# EAGLE design dcc_block_detector (EAGLE 7.2.0)
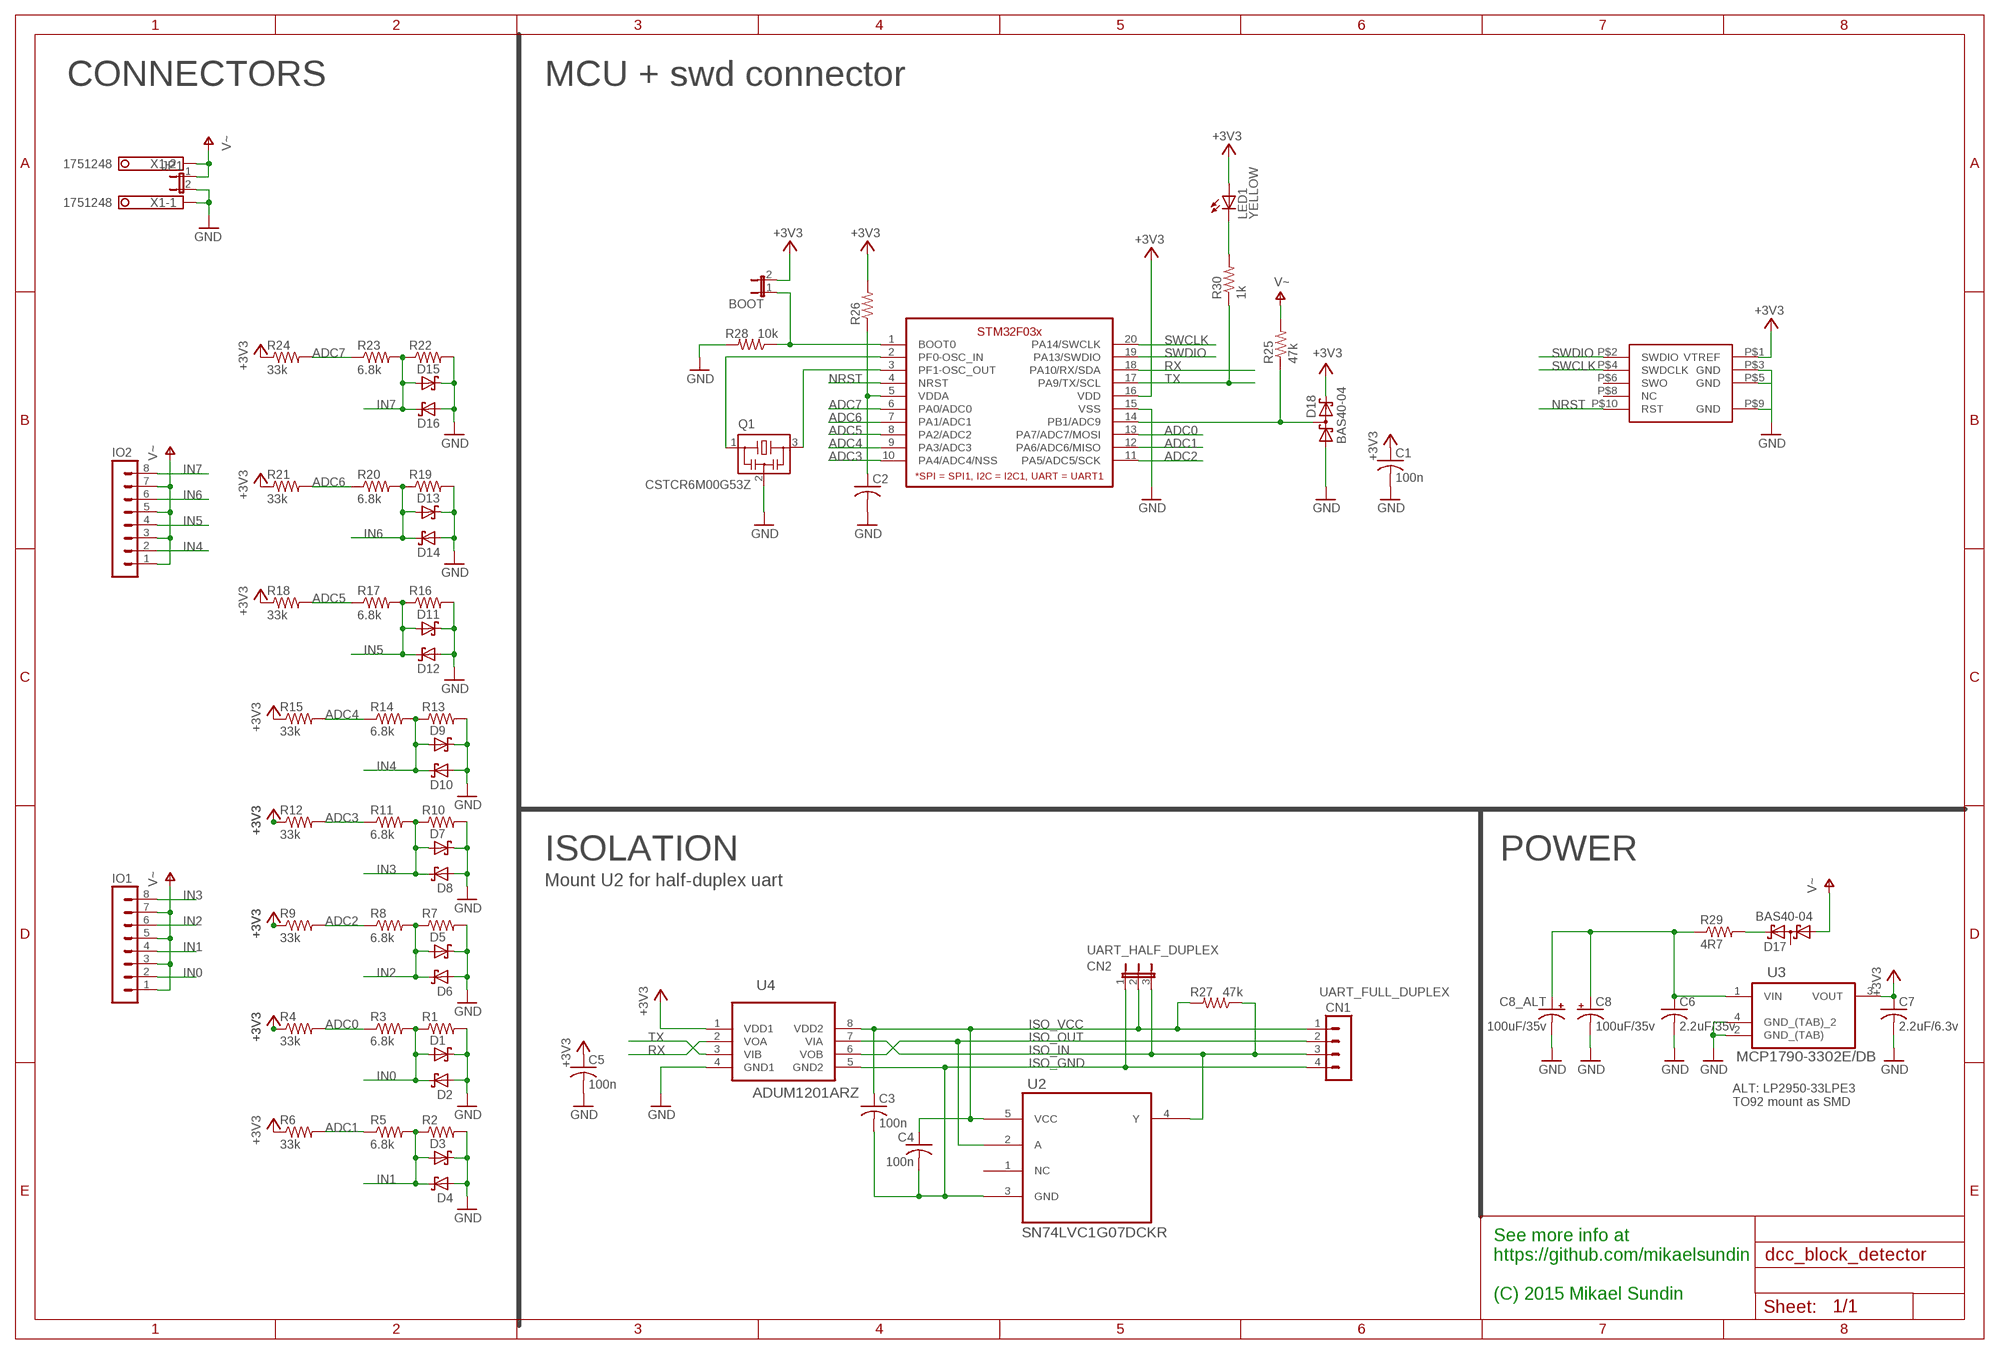
[diagram p0: schematic, sheet 1]

## Parts
BOOT  JP1E  [JP1]
C1  100n  C-USC0603  [C0603]
C2  C-USC0603  [C0603]
C3  100n  C-USC0603  [C0603]
C4  100n  C-USC0603  [C0603]
C5  100n  C-USC0603  [C0603]
C6  2.2uF/35v  C-USC0805  [C0805]
C7  2.2uF/6.3v  C-USC0805  [C0805]
C8  100uF/35v  CPOL-USUD-6,3X7,7  [UD-6,3X7,7_NICHICON]
C8_ALT  100uF/35v  CPOL-USE2.5-6  [E2,5-6]
CN1  UART_FULL_DUPLEX  MA04-1  [MA04-1]
CN2  UART_HALF_DUPLEX  JP2E  [JP2]
D1  SCHOTTKY-DIODESMC  [SMC]
D2  SCHOTTKY-DIODESMC  [SMC]
D3  SCHOTTKY-DIODESMC  [SMC]
D4  SCHOTTKY-DIODESMC  [SMC]
D5  SCHOTTKY-DIODESMC  [SMC]
D6  SCHOTTKY-DIODESMC  [SMC]
D7  SCHOTTKY-DIODESMC  [SMC]
D8  SCHOTTKY-DIODESMC  [SMC]
D9  SCHOTTKY-DIODESMC  [SMC]
D10  SCHOTTKY-DIODESMC  [SMC]
D11  SCHOTTKY-DIODESMC  [SMC]
D12  SCHOTTKY-DIODESMC  [SMC]
D13  SCHOTTKY-DIODESMC  [SMC]
D14  SCHOTTKY-DIODESMC  [SMC]
D15  SCHOTTKY-DIODESMC  [SMC]
D16  SCHOTTKY-DIODESMC  [SMC]
D17  BAS40-04  [SOT23]
D18  BAS40-04  [SOT23]
IO1  MA08-1W  [MA08-1W]
IO2  MA08-1W  [MA08-1W]
JP1  JP1E  [JP1]
LED1  YELLOW  LEDCHIPLED_0603  [CHIPLED_0603]
Q1  CSTCR6M00G53Z  [CSTER12M]
R1  R-US_R1206  [R1206]
R2  R-US_R1206  [R1206]
R3  6.8k  R-US_R0603  [R0603]
R4  33k  R-US_R0603  [R0603]
R5  6.8k  R-US_R0603  [R0603]
R6  33k  R-US_R0603  [R0603]
R7  R-US_R1206  [R1206]
R8  6.8k  R-US_R0603  [R0603]
R9  33k  R-US_R0603  [R0603]
R10  R-US_R1206  [R1206]
R11  6.8k  R-US_R0603  [R0603]
R12  33k  R-US_R0603  [R0603]
R13  R-US_R1206  [R1206]
R14  6.8k  R-US_R0603  [R0603]
R15  33k  R-US_R0603  [R0603]
R16  R-US_R1206  [R1206]
R17  6.8k  R-US_R0603  [R0603]
R18  33k  R-US_R0603  [R0603]
R19  R-US_R1206  [R1206]
R20  6.8k  R-US_R0603  [R0603]
R21  33k  R-US_R0603  [R0603]
R22  R-US_R1206  [R1206]
R23  6.8k  R-US_R0603  [R0603]
R24  33k  R-US_R0603  [R0603]
R25  47k  R-US_R0603  [R0603]
R26  R-US_R0603  [R0603]
R27  47k  R-US_R0603  [R0603]
R28  10k  R-US_R0603  [R0603]
R29  4R7  R-US_R1206  [R1206]
R30  1k  R-US_R0603  [R0603]
U2  SN74LVC1G07DCKR  [SOT65P210X110-5N]
U3  MCP1790-3302E/DB  [SOT230P700X180-4N]
U4  ADUM1201ARZ  [SOIC127P600X175-8N]
U$1  STM32F03X_TSSOP20  [STM32F03X_TSSOP20]
U$2  SWD  ARM_SWD_2X5  [ARM_SWD_2X5]
X1  1751248  [1751248]

## Nets
+3V3: BOOT.2 C1.1 C5.1 C7.1 D18.2(C2) LED1.A R4.1 R6.1 R9.1 R12.1 R15.1 R18.1 R21.1 R24.1 R26.2 U3.3(VOUT) U4.1(VDD1) U$1.16(VDD) U$2.P$1(VTREF)
ADC0: R3.1 R4.2 U$1.13(PA7/ADC7/MOSI)
ADC1: R5.1 R6.2 U$1.12(PA6/ADC6/MISO)
ADC2: R8.1 R9.2 U$1.11(PA5/ADC5/SCK)
ADC3: R11.1 R12.2 U$1.10(PA4/ADC4/NSS)
ADC4: R14.1 R15.2 U$1.9(PA3/ADC3)
ADC5: R17.1 R18.2 U$1.8(PA2/ADC2)
ADC6: R20.1 R21.2 U$1.7(PA1/ADC1)
ADC7: R23.1 R24.2 U$1.6(PA0/ADC0)
GND: C1.2 C2.2 C5.2 C6.2 C7.2 C8.- C8_ALT.- D1.C D2.A D3.C D4.A D5.C D6.A D7.C D8.A D9.C D10.A D11.C D12.A D13.C D14.A D15.C D16.A D18.1(A1) JP1.2 Q1.2 R1.2 R2.2 R7.2 R10.2 R13.2 R16.2 R19.2 R22.2 R28.2 U3.2(GND_(TAB)) U3.4(GND_(TAB)_2) U4.4(GND1) U$1.15(VSS) U$2.P$3(GND) U$2.P$5(GND) U$2.P$9(GND) X1.1
IN0: D1.A D2.C IO1.2 R1.1 R3.2
IN1: D3.A D4.C IO1.4 R2.1 R5.2
IN2: D5.A D6.C IO1.6 R7.1 R8.2
IN3: D7.A D8.C IO1.8 R10.1 R11.2
IN4: D9.A D10.C IO2.2 R13.1 R14.2
IN5: D11.A D12.C IO2.4 R16.1 R17.2
IN6: D13.A D14.C IO2.6 R19.1 R20.2
IN7: D15.A D16.C IO2.8 R22.1 R23.2
ISO_GND: C3.2 C4.2 CN1.4 CN2.1 U2.3(GND) U4.5(GND2)
ISO_IN: CN1.3 CN2.3 R27.1 U2.4(Y) U4.7(VIA)
ISO_OUT: CN1.2 U2.2(A) U4.6(VOB)
ISO_VCC: C3.1 C4.1 CN1.1 CN2.2 R27.2 U2.5(VCC) U4.8(VDD2)
N$1: D18.3(C1A2) R25.1 U$1.14(PB1/ADC9)
N$2: C2.1 R26.1 U$1.5(VDDA)
N$3: D17.2(C2) R29.2
N$4: Q1.1 U$1.2(PF0-OSC_IN)
N$5: Q1.3 U$1.3(PF1-OSC_OUT)
N$6: BOOT.1 R28.1 U$1.1(BOOT0)
N$7: C6.1 C8.+ C8_ALT.+ R29.1 U3.1(VIN)
N$8: LED1.C R30.2
NRST: U$1.4(NRST) U$2.P$10(RST)
RX: U4.2(VOA) U$1.18(PA10/RX/SDA)
SWCLK: U$1.20(PA14/SWCLK) U$2.P$4(SWDCLK)
SWDIO: U$1.19(PA13/SWDIO) U$2.P$2(SWDIO)
TX: R30.1 U4.3(VIB) U$1.17(PA9/TX/SCL)
V+: D17.1(A1) IO1.1 IO1.3 IO1.5 IO1.7 IO2.1 IO2.3 IO2.5 IO2.7 JP1.1 R25.2 X1.2 ; supply symbol labelled V~
Unconnected: D17.3(C1A2) U2.1(NC) U$2.P$6(SWO) U$2.P$8(NC)

## Notes on the sheet
- CONNECTORS | MCU + swd connector
- ISOLATION | POWER
- Mount U2 for half-duplex uart
- ALT: LP2950-33LPE3
  TO92 mount as SMD
- See more info at
  https://github.com/mikaelsundin
  
  (C) 2015 Mikael Sundin

## Library data of the parts
BOOT JP1 = jumper:JP1E: JUMPER
C1-C7 = rcl:C-US: CAPACITOR, American symbol
C8 C8_ALT = rcl:CPOL-US: POLARIZED CAPACITOR, American symbol
CN1 = con-lstb:MA04-1: PIN HEADER; OC_FARNELL: unknown; OC_NEWARK: unknown
CN2 = jumper:JP2E: JUMPER
D1-D16 = diode:SCHOTTKY-DIODE: Schottky Diode
D17 D18 = diode:BAS40-04: Silicon Schottky Diodes General-purpose diode for high-speed switching
IO1 IO2 = con-lstb:MA08-1W: PIN HEADER; OC_FARNELL: unknown; OC_NEWARK: unknown
LED1 = led:LED: LED OSRAM: - CHIPLED LG R971, LG N971, LY N971, LG Q971, LY Q971, LO R971, LY R971 LH N974, LH R974 LS Q976, LO Q976, LY Q976 LO Q996 - Hyper CHIPLED LW Q18S LB Q993, LB Q99A, LB R99A - SideLED LS A670, LO A670, LY A670, LG A670, LP A670 LB A673, LV A673, LT A673, LW A673 LH A674 LY A675 LS A676, LA A676, LO A676, LY A676, LW A676 LS A679, LY A679, LG A679 - Hyper Micro SIDELED® LS Y876, LA Y876, LO Y876, LY Y876 LT Y87S - SmartLED LW L88C, LW L88S LB L89C, LB L89S, LG L890 LS L89K, LO L89K, LY L89K LS L896, LA L896, LO L896, LY L896 - TOPLED LS T670, LO T670, LY T670, LG T670, LP T670 LSG T670, LSP T670, LSY T670, LOP T670, LYG T670 LG T671, LOG T671, LSG T671 LB T673, LV T673, LT T673, LW T673 LH T674 LS T676, LA T676, LO T676, LY T676, LB T676, LH T676, LSB T676, LW T676 LB T67C, LV T67C, LT T67C, LS T67K, LO T67K, LY T67K, LW E67C LS E67B, LA E67B, LO E67B, LY E67B, LB E67C, LV E67C, LT E67C LW T67C LS T679, LY T679, LG T679 LS T770, LO T770, LY T770, LG T770, LP T770 LB T773, LV T773, LT T773, LW T773 LH T774 LS E675, LA E675, LY E675, LS T675 LS T776, LA T776, LO T776, LY T776, LB T776 LHGB T686 LT T68C, LB T68C - Hyper Mini TOPLED® LB M676 - Mini TOPLED Santana® LG M470 LS M47K, LO M47K, LY M47K Source: http://www.osram.convergy.de LUXEON: - LUMILED® LXK2-PW12-R00, LXK2-PW12-S00, LXK2-PW14-U00, LXK2-PW14-V00 LXK2-PM12-R00, LXK2-PM12-S00, LXK2-PM14-U00 LXK2-PE12-Q00, LXK2-PE12-R00, LXK2-PE12-S00, LXK2-PE14-T00, LXK2-PE14-U00 LXK2-PB12-K00, LXK2-PB12-L00, LXK2-PB12-M00, LXK2-PB14-N00, LXK2-PB14-P00, LXK2-PB14-Q00 LXK2-PR12-L00, LXK2-PR12-M00, LXK2-PR14-Q00, LXK2-PR14-R00 LXK2-PD12-Q00, LXK2-PD12-R00, LXK2-PD12-S00 LXK2-PH12-R00, LXK2-PH12-S00 LXK2-PL12-P00, LXK2-PL12-Q00, LXK2-PL12-R00 Source: www.luxeon.com KINGBRIGHT: KA-3528ASYC Source: www.kingbright.com
Q1 = cstce-resonator:CSTCR: Resonator Source: murata.co.jp; MPN: CSTCC12M0; OC_FARNELL: 1170434; OC_NEWARK: 25M8759
R1-R30 = rcl:R-US_: RESISTOR, American symbol
U2 = logic:SN74LVC1G07DCKR: SINGLE BUFFER/DRIVER WITH OPEN-DRAIN OUTPUT; MPN: SN74LVC1G07DCKR; OC_FARNELL: 1287544; OC_NEWARK: 76C4075; PACKAGE: SC70-5; SUPPLIER: Texas Instruments
U3 = lib:MCP1790-3302E/DB: IC, LDO VOLT REG, 3.3V, 70mA; MPN: MCP1790-3302E/DB; OC_FARNELL: 1675422; OC_NEWARK: 40M0645; PACKAGE: SOT-223-3; SUPPLIER: Microchip
U4 = lib:ADUM1201ARZ: Dual-Channel Digital Isolators; MPN: ADUM1201ARZ; OC_FARNELL: 1078200; OC_NEWARK: 19M0753; PACKAGE: SOIC-8; SUPPLIER: Analog Devices
U$1 = stm32f03x:STM32F03X_TSSOP20
U$2 = lib:ARM_SWD_2X5
X1 = con-phoenix-350:1751248: MKDS 1/ 2-3,5 Printklemme Nennstrom: 10 A Bemessungsspannung: 160 V Raster: 3,5 mm Polzahl: 2 Montageart: Löten Anschlussart: Schraubanschluss Anschlussrichtung vom Leiter zur Platine: 0° Source: http://eshop.phoenixcontact.com .. 1751248.pdf; OC_FARNELL: unknown; OC_NEWARK: unknown

## Board
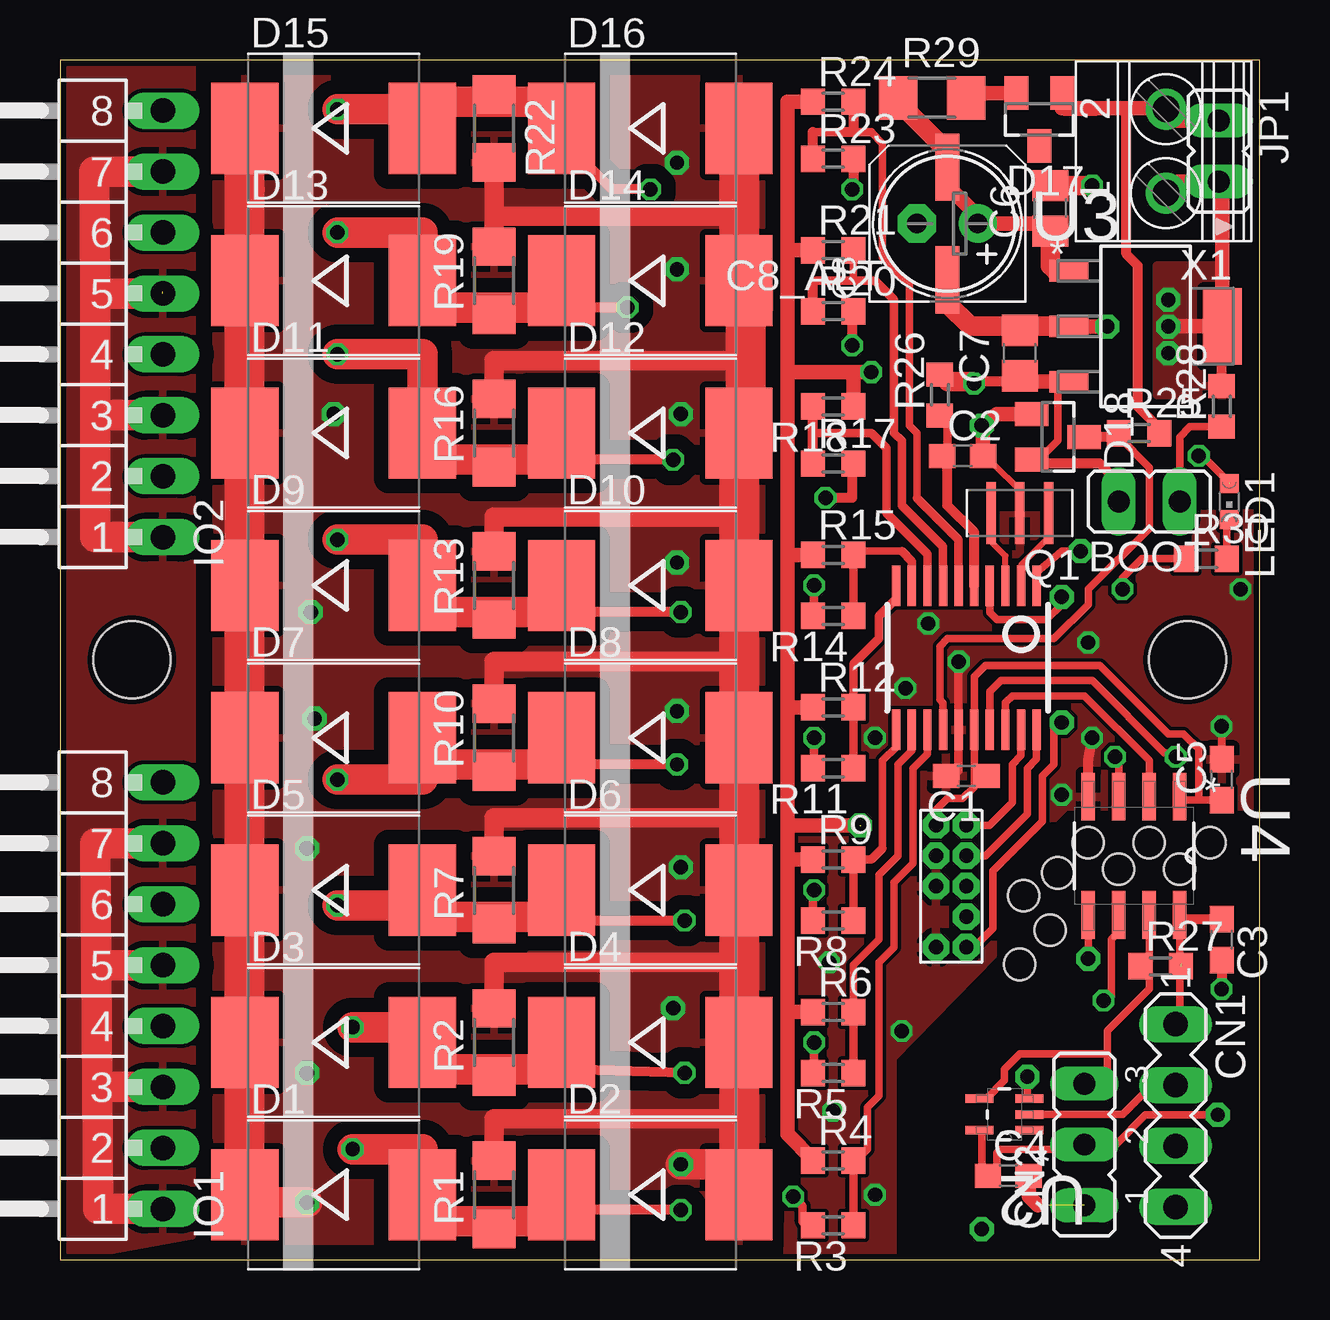
[diagram p1: board, top side]
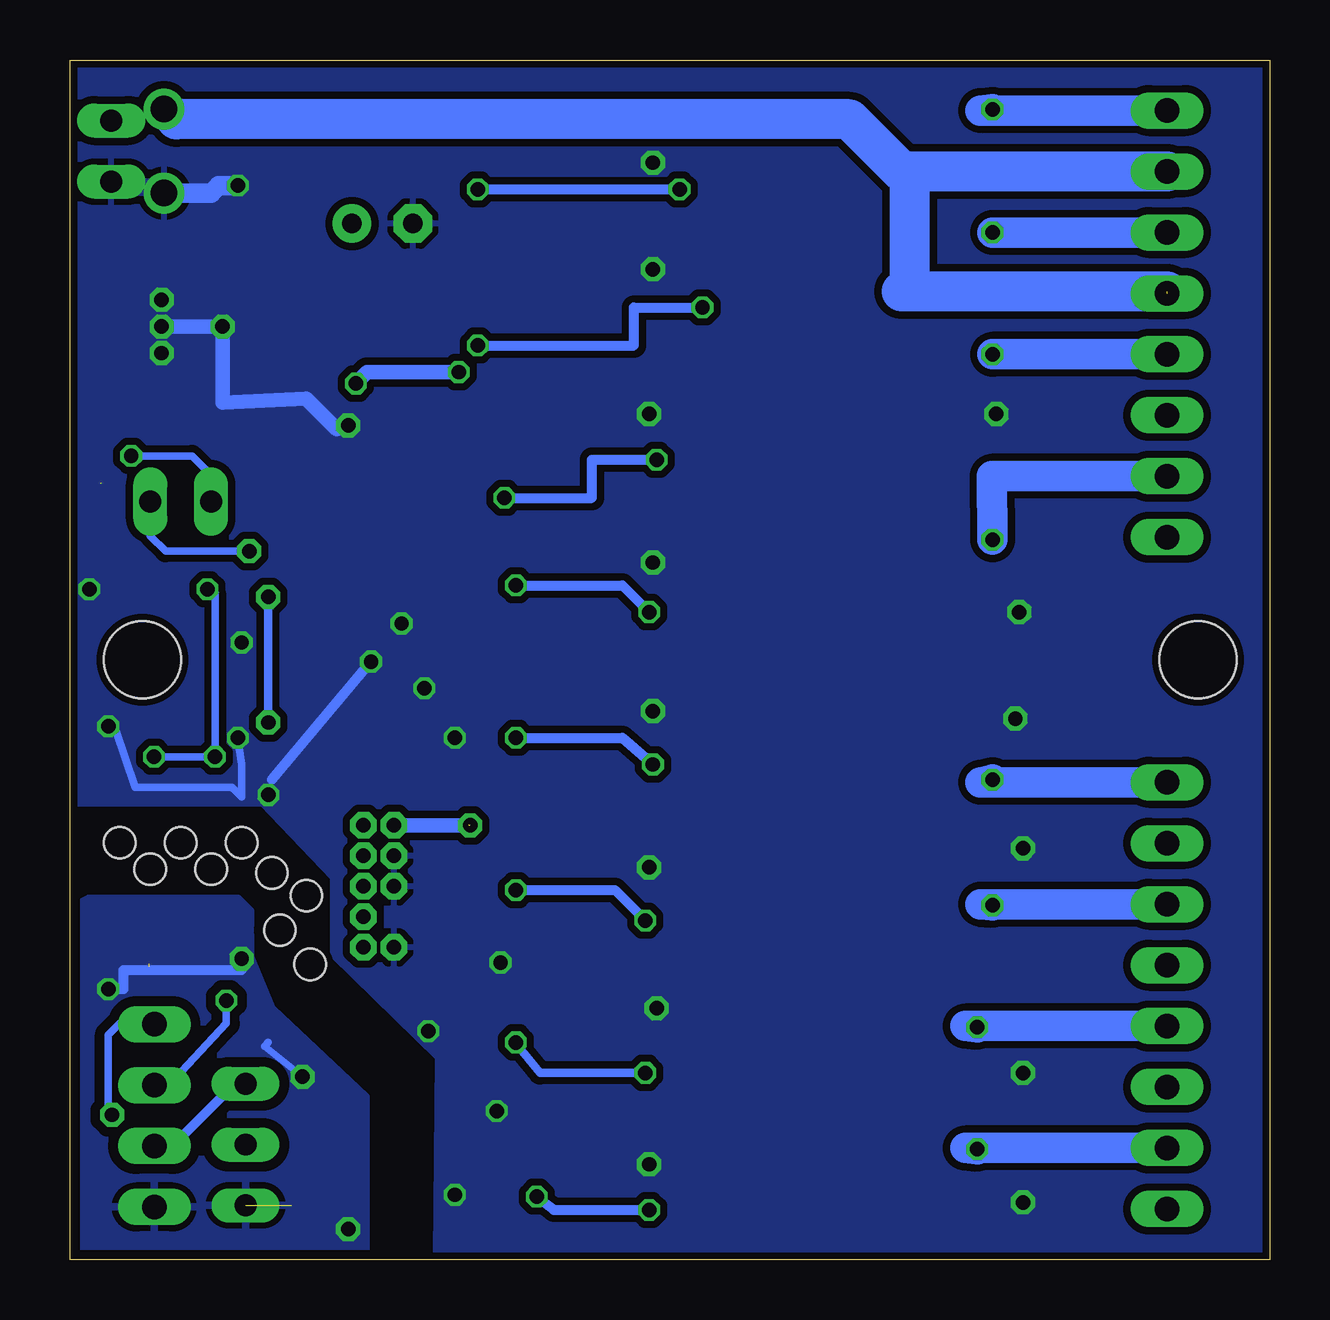
[diagram p2: board, bottom side, seen from below]

Size 50 x 50 mm. Coordinates in mm from the lower left corner, seen from the top.
Outline: 0,0 50,0 50,50 0,50 0,0
Copper layers (1*16): Top 0.035mm / dielectric 1.5mm / Bottom 0.035mm
Design rules "Elecrow_2-layer_eagle_rule": minimum track width 6mil, minimum drill 12mil, track to track 6mil, track to pad 6mil, pad to pad 6mil, via to via 6mil, smd to smd 0mil, copper to edge 10mil, drill to drill 10mil, minimum pad ring 10mil, minimum via ring 6mil, stop-mask expansion 2mil, vias tented up to drill 100mil, thermal gap 10mil
Holes 3.2 mm at 3,25 47,25
Holes 1.3 mm at 42.86,17.38 44.13,16.27 45.4,17.38 46.67,16.27 40.01,12.3 41.59,16.11 40.16,15.16 41.27,13.73 47.94,17.38

### Footprints (pad centres in the part's own frame; a part is rotated, then mirrored left to right if it is on the bottom)
JP1 = drill 0.914 long: 1 0,-1.27; 2 0,1.27
C0603 = smd 1.1 x 1: 1 -0.85,0; 2 0.85,0
C0805 = smd 1.3 x 1.5: 1 -0.95,0; 2 0.95,0
UD-6,3X7,7_NICHICON = smd 2.8 x 1: + 2.35,0; - -2.35,0
E2,5-6 = drill 0.813 pad 1.6: + -1.27,0 | drill 0.813 pad 1.6 octagon: - 1.27,0
MA04-1 = drill 1.016 long: 1 -3.81,0; 2 -1.27,0; 3 1.27,0; 4 3.81,0
JP2 = drill 0.914 long: 1 -2.54,0; 2 0,0; 3 2.54,0
SMC = smd 2.8 x 3.8: A 3.7,0; C -3.7,0
SOT23 = smd 1 x 1.4: 1 -0.95,-1.1; 2 0.95,-1.1; 3 0,1.1
MA08-1W = drill 1.016 long: 1 -8.89,0; 2 -6.35,0; 3 -3.81,0; 4 -1.27,0; 5 1.27,0; 6 3.81,0; 7 6.35,0; 8 8.89,0
CHIPLED_0603 = smd 0.8 x 0.8: A 0,-0.75; C 0,0.75
CSTER12M = smd 0.4 x 2.6: 1 -1.2,0; 2 0,0; 3 1.2,0
R1206 = smd 1.6 x 1.803: 1 -1.422,0; 2 1.422,0
R0603 = smd 1 x 1.1: 1 -0.85,0; 2 0.85,0
SOT65P210X110-5N = smd 1.168 x 0.356: 1 -1.041,0.66; 2 -1.041,0; 3 -1.041,-0.66; 4 1.041,-0.66; 5 1.041,0.66
SOT230P700X180-4N = smd 1.626 x 0.889: 1 -3.2,2.311; 2 -3.2,0; 3 -3.2,-2.311 | smd 1.626 x 3.175: 4 3.2,0
SOIC127P600X175-8N = smd 1.981 x 0.559: 1 -2.464,1.905; 2 -2.464,0.635; 3 -2.464,-0.635; 4 -2.464,-1.905; 5 2.464,-1.905; 6 2.464,-0.635; 7 2.464,0.635; 8 2.464,1.905
STM32F03X_TSSOP20 = smd 0.35 x 1.7: 1 -2.925,-3; 2 -2.275,-3; 3 -1.625,-3; 4 -0.975,-3; 5 -0.325,-3; 6 0.325,-3; 7 0.975,-3; 8 1.625,-3; 9 2.275,-3; 10 2.925,-3; 11 2.925,3; 12 2.275,3; 13 1.625,3; 14 0.975,3; 15 0.325,3; 16 -0.325,3; 17 -0.975,3; 18 -1.625,3; 19 -2.275,3; 20 -2.925,3
ARM_SWD_2X5 = drill 0.6 pad 1 octagon: P$1 2.54,0.635; P$2 2.54,-0.635; P$3 1.27,0.635; P$4 1.27,-0.635; P$5 0,0.635; P$6 0,-0.635; P$8 -1.27,-0.635; P$9 -2.54,0.635; P$10 -2.54,-0.635
1751248 = drill 1.1 pad 1.7: 1 -1.75,-0.1; 2 1.75,-0.1

### Placement (x,y rotation side)
BOOT  45.4,31.59 90 top
C1  37.78,20.16 180 top
C2  37.62,33.5 0 top
C3  48.42,13.34 270 top
C4  39.53,3.49 0 top
C5  48.42,20 90 top
C6  41.27,43.81 90 top
C7  40.01,37.78 90 top
C8  36.99,43.18 90 top
C8_ALT  36.99,43.18 180 top
CN1  46.5,6 270 top
CN2  42.7,4.79 90 top
D1  11.41,2.7 0 top
D2  24.61,2.7 0 top
D3  11.41,9.05 0 top
D4  24.61,9.05 0 top
D5  11.41,15.4 0 top
D6  24.61,15.4 0 top
D7  11.41,21.75 0 top
D8  24.61,21.75 0 top
D9  11.41,28.1 0 top
D10  24.61,28.1 0 top
D11  11.41,34.45 0 top
D12  24.61,34.45 0 top
D13  11.41,40.8 0 top
D14  24.61,40.8 0 top
D15  11.41,47.15 0 top
D16  24.61,47.15 0 top
D17  40.82,47.52 180 top
D18  41.59,34.29 270 top
IO1  4.29,11 90 top
IO2  4.29,39 90 top
JP1  48.3,46.2 180 top
LED1  48.74,31.59 180 top
Q1  40.01,31.11 180 top
R1  18.1,2.7 90 top
R2  18.1,9.05 90 top
R3  32.23,1.43 180 top
R4  32.23,4.13 0 top
R5  32.23,7.78 180 top
R6  32.23,10.32 0 top
R7  18.1,15.4 90 top
R8  32.23,14.13 180 top
R9  32.23,16.67 0 top
R10  18.1,21.75 90 top
R11  32.23,20.48 180 top
R12  32.23,23.02 0 top
R13  18.1,28.1 90 top
R14  32.23,26.83 180 top
R15  32.23,29.37 0 top
R16  18.1,34.45 90 top
R17  32.23,33.18 0 top
R18  32.23,35.56 180 top
R19  18.1,40.8 90 top
R20  32.23,39.53 0 top
R21  32.23,42.07 0 top
R22  18.1,47.15 270 top
R23  32.23,45.88 0 top
R24  32.23,48.26 0 top
R25  44.98,34.45 0 top
R26  36.67,36.04 90 top
R27  45.88,12.22 0 top
R28  48.42,35.56 90 top
R29  36.35,48.42 0 top
R30  47.78,29.21 0 top
U2  39.37,6.05 180 top
U3  45.25,38.9 0 top
U4  44.77,16.83 270 top
U$1  37.78,25.08 180 top
U$2  37.15,15.56 90 top
X1  46,46.2 90 top

### Tracks (layer width: path | path; a pad name or v marks a point on that pad's centre or on a via)
+3V3  (via drill 0.6, 0.6 pad 1)  (2 unrouted)
  Top 0.305: D18.2 41.12,33.66 41.59,34.13 41.59,36.35 42.12,36.35 | 42.7,36.35 42.12,36.35 | 42.12,36.35 U3.3 | C5.1 47.47,19.15 | 47.47,19.15 46.81,19.15 U4.1 46.67,18.89 | U$2.P$1 36.51,18.73 36.99,19.21 37.62,19.21 38.11,19.69 38.11,20.16 | 38.11,20.16 U$1.16 38.11,24.3 38.58,24.77 43.34,24.77 46.2,21.91 46.83,21.91 47.47,21.27 47.47,19.15 | C1.1 38.11,20.16 | 48.74,32.38 47.62,33.5 v47.47,33.5
  Top 0.406: R4.1 31.41,4.13 | 40.01,36.59 37.01,36.59 | BOOT.2 44.13,32.38 43.34,33.18 40.65,33.18 D18.2
  Top 0.61: 31.41,4.13 30.32,5.24 30.32,10.48 | 30.32,10.48 30.32,16.83 | 30.32,16.83 30.32,18.1 | 30.32,18.1 30.32,23.02 | 30.32,23.02 30.32,29.53 | 30.32,29.53 30.32,36.99 | 30.32,36.99 30.32,42.07 | 30.32,42.07 30.32,48.26 R24.1 | 33.39,18.1 30.32,18.1 | R18.1 33.08,36.99 | 33.08,36.99 30.32,36.99 | v33.81,36.99 33.08,36.99 | U3.3 40.01,36.59 | 36.99,36.59 37.01,36.59 R26.2 36.99,36.59 | 36.99,36.62 36.99,36.59 | R21.1 30.32,42.07 | R15.1 30.48,29.37 30.32,29.53 | R12.1 30.32,23.02 | R9.1 30.48,16.67 30.32,16.83 | R6.1 30.48,10.32 30.32,10.48
  Top 0.813: C7.1 40.01,36.59 | 37.01,36.59 38.03,36.59 v38.1,36.51
  Bottom 0.305: 47.47,33.66 v47.47,33.5 44.93,33.5 44.13,32.7 BOOT.2
  Bottom 0.61: v38.1,36.51 37.62,36.99 v33.81,36.99 | U$2.P$1 v33.34,18.1
ADC0
  Top 0.305: 32.86,3.91 R4.2 33.18,4.13 33.66,4.6 33.66,6.35 34.13,6.83 34.13,12.38 34.77,13.02 34.77,15.72 35.56,16.51 35.56,20.48 36.16,21.08 U$1.13
  Top 0.356: R3.1 R4.2
ADC1
  Top 0.305: U$1.12 35.51,21.22 34.92,20.64 34.92,16.83 34.13,16.03 34.13,13.34 33.08,12.28 R6.2
  Top 0.356: R5.1 R6.2
ADC2
  Top 0.305: U$1.11 34.86,21.36 34.29,20.8 34.29,17.14
  Top 0.356: R8.1 R9.2 33.81,16.67 34.29,17.14
ADC3
  Top 0.356: 33.02,22.96 R12.2 | R11.1 R12.2 | R12.2 33.08,24.82 34.13,25.88 34.13,26.83 34.86,27.55 U$1.10
ADC4
  Top 0.305: 35.08,29.53 33.23,29.53 R15.2 33.02,29.31
  Top 0.356: U$1.9 35.51,29.1 35.08,29.53 | R14.1 R15.2
ADC5
  Top 0.356: U$1.8 36.16,29.41 34.45,31.11 34.45,33.81 33.81,34.45 31.38,34.45
  Top 0.406: R17.1 31.38,34.45 R18.2
ADC6
  Top 0.305: R21.2 33.08,40.8 33.66,40.8
  Top 0.356: U$1.7 36.81,29.71 35.08,31.43 35.08,34.13 34.77,34.45 34.77,40.01 33.97,40.8 33.66,40.8 31.54,40.8 31.38,40.64
  Top 0.406: R20.1 31.38,40.64
ADC7
  Top 0.305: 35.72,31.75 35.72,34.45 35.4,34.77 35.4,40.64 34.29,41.75 34.29,46.51 33.81,46.99
  Top 0.356: U$1.6 37.46,30.01 35.72,31.75 | 33.81,46.99 32.54,46.99 31.38,46.99
  Top 0.406: R23.1 31.38,46.99 | R24.2 33.08,46.99 32.54,46.99
GND  (via drill 0.6, 0.6 pad 1)
  Top 0.254: C2.2 38.89,33.18 40.01,32.07 Q1.2
  Top 0.305: C5.2 v48.42,22.23
  Top 0.356: v37.47,24.92 37.46,24.93 U$1.15 37.46,20.37 C1.2
  Top 0.406: R28.2 48.42,38.71 U3.4 | U4.4 42.94,19.29 42.86,19.37 42.86,20.8 v43.02,21.75
  Top 0.61: D18.1 39.05,35.24 v38.42,34.77 38.47,34.82 C2.2 | v43.66,38.89 U3.2 | v46.2,38.89 46.04,38.9 U3.4 48.45,44.74 48.26,44.93 46.58,44.93 X1.1 | 7.87,44.45 7.71,44.61
  Top 0.813: R1.2 18.1,5.87 28.31,5.87 | R2.2 18.1,12.38 28.31,12.38 | R7.2 18.1,18.41 28.31,18.41 | R10.2 18.1,24.92 28.31,24.92 | R13.2 18.1,30.96 28.31,30.96 | R16.2 18.1,37.47 28.57,37.47 | R19.2 18.1,43.5 | 18.1,43.5 28.31,43.5 | R22.2 18.1,43.5 | U3.2 39.85,38.9 | 39.85,38.9 37.94,38.9 36.99,39.85 C8.- | C6.2 v43.02,44.77 | C7.2 39.85,38.9
  Top 1.27: v25.88,3.97 27.99,3.97 28.31,3.65 | v10.29,2.38 8.02,2.38 D1.C
  Top 1.676: D1.C D3.C D5.C D7.C D9.C D11.C D13.C 7.71,44.61 D15.C | D16.A 28.31,43.5 28.31,40.48 28.89,40.48 28.89,39.69 28.57,39.69 28.57,37.47 28.57,34.45 D12.A 28.31,30.96 D10.A 28.31,24.92 D8.A 28.31,18.41 D6.A 28.31,12.38 D4.A | D4.A 28.31,8.57 28.26,8.57 | D4.A 28.31,5.87 28.31,3.65 28.31,3.33 28.1,3.33
  Bottom 0.305: v48.42,22.23 48.1,22.07 47.31,19.68 43.26,19.68 U4.4 42.86,20.64 v43.02,21.75
  Bottom 0.406: 41.59,20 v37.47,24.92
  Bottom 0.61: v38.42,34.77 38.89,34.61 40.16,35.88 43.66,35.72 v43.66,38.89 v46.2,38.89
  Bottom 0.813: v43.02,44.77 43.81,44.77 44.13,44.45 X1.1
  other vias: 25.72,45.72 25.72,41.27 25.88,35.24 25.72,29.05 25.72,22.86 25.88,16.35 25.56,10.48 10.29,7.78 10.29,17.14 10.61,22.54 10.45,26.99 11.41,35.24 35.24,23.81 36.2,26.51 42.86,25.72 41.75,19.37 33.97,21.75 49.21,27.94 35.08,9.53 33.97,2.7 32.23,6.19 32.07,12.38 46.2,40.01 46.2,37.78
  pour Bottom (isolate 0.305): 0,0 34.76,0.16 34.68,8.4 39.05,12.68 39.05,15.89 42,19 50,19 50,50 0,50
  pour Top (isolate 0.61): 6.5,52.5 6.5,-1.5 30,-2 30,52
  pour Top: 30.96,30.96 30.32,0 34.7,0 34.7,8.41 38.89,12.7 38.89,15.88 41.91,18.89 50.48,18.89 50.64,31.11
  pour Top: 45.72,41.43 45.72,36.04 48.58,36.04 48.58,41.43
IN0  (via drill 0.6)
  Top 0.305: R1.1 18,1.75 17.84,1.59
  Top 0.356: R3.2 31.11,1.43 30.96,1.59 30.96,2.22 v30.56,2.62
  Top 0.406: v25.88,2.06 21.91,2.06 21.43,1.59 21.11,1.43 20.95,1.59
  Top 1.27: D2.C 20.95,2.7 20.95,1.59 17.84,1.59 15.11,1.59 D1.A 15.11,4.6 v12.2,4.6
  Bottom 0.406: v30.56,2.62 29.84,2.06 v25.88,2.06
  Bottom 1.27: IO1.2 12.7,4.65 v12.2,4.6
IN1  (via drill 0.6)
  Top 0.305: R2.1 18,8.1 17.84,7.94
  Top 0.356: v31.43,9.05 31.43,7.72 R5.2
  Top 0.406: v26.04,7.78 20.95,7.94
  Top 1.27: D4.C 20.95,9.05 20.95,7.94 17.84,7.94 15.11,7.94 D3.A 15.11,9.68 v12.2,9.68
  Bottom 0.356: v26.04,7.78 30.42,7.78 31.38,8.95 v31.43,9.05
  Bottom 1.27: IO1.4 12.7,9.73 v12.2,9.68
IN2  (via drill 0.6)
  Top 0.356: R8.2 31.38,15.3 v31.43,15.4
  Top 0.406: 20.95,14.29 21.11,14.13 v26.04,14.13
  Top 0.813: R7.1 18.1,14.29 17.78,14.29
  Top 1.27: 15.11,14.76 15.11,14.29 17.78,14.29 20.95,14.29 20.95,15.4 D6.C | v11.56,14.76 15.11,14.76 | 15.11,14.76 D5.A
  Bottom 0.406: v31.43,15.4 27.3,15.4 v26.04,14.13
  Bottom 1.27: IO1.6 12.06,14.81 v11.56,14.76
IN3  (via drill 0.6)
  Top 0.356: v31.43,21.75 31.43,20.95 31.38,20.9 R11.2
  Top 0.406: v25.72,20.64 20.95,20.64
  Top 0.813: R10.1 18.1,20.64 17.94,20.64
  Top 1.27: D8.C 20.95,21.75 20.95,20.64 17.94,20.64 15.22,20.64 15.22,20.8 15.11,20.8 D7.A 15.11,20 v11.56,20
  Bottom 0.406: v31.43,21.75 26.99,21.75 v25.72,20.64
  Bottom 1.27: IO1.8 12.06,19.89 v11.56,20
IN4  (via drill 0.6)
  Top 0.356: v31.43,28.1 31.43,26.89 R14.2
  Top 0.406: 20.8,28.1 D10.C | v25.88,26.99 20.8,26.99
  Top 0.813: R13.1 18.1,26.99 17.62,26.99
  Top 1.27: 20.8,28.1 20.8,26.99 17.62,26.99 15.38,26.99 15.38,27.15 15.11,27.15 D9.A 15.11,30 v11.56,30
  Bottom 0.406: v31.43,28.1 26.99,28.1 v25.88,26.99
  Bottom 1.27: IO2.2 11.59,32.65 v11.56,30
IN5  (via drill 0.6)
  Top 0.406: R17.2 33.02,33.18 33.02,31.75 v31.91,31.75 | v25.56,33.34 20.95,33.34
  Top 0.813: R16.1 18.1,33.34
  Top 1.27: D12.C 20.95,34.45 20.95,33.34 18.1,33.34 15.53,33.34 15.53,33.5 15.11,33.5 D11.A 15.11,37.73 v11.56,37.73
  Bottom 0.406: v31.91,31.75 28.26,31.75 28.26,33.34 v25.56,33.34
  Bottom 1.27: IO2.4 v11.56,37.73
IN6  (via drill 0.6)
  Top 0.406: 20.8,40.8 D14.C | R20.2 33.02,39.53 v33.02,38.1 | v23.65,39.69 20.95,39.69
  Top 0.813: R19.1 18.1,39.69 17.78,39.69
  Top 1.27: D14.C 20.95,40.8 20.95,39.69 17.78,39.69 15.53,39.69 15.53,39.85 15.38,39.85 15.38,40.8 D13.A 15.11,42.81 v11.56,42.81
  Bottom 0.406: v33.02,38.1 26.51,38.1 26.51,39.69 v23.65,39.69
  Bottom 1.27: IO2.6 v11.56,42.81
IN7  (via drill 0.6)
  Top 0.406: R23.2 33.08,44.61 v33.02,44.61 | v24.61,44.61 23.02,44.61 21.75,45.88 20.95,46.04
  Top 0.61: R22.1 18.1,48.26 17.94,48.26
  Top 1.27: 15.11,46.04 D15.A 15.11,47.94 | 20.95,46.04 20.95,47.15 | 15.11,47.94 15.11,48.26 17.94,48.26 20.95,48.26 20.95,47.15 | 20.95,47.15 D16.C | v11.56,47.94 15.11,47.94
  Bottom 0.406: v33.02,44.61 v24.61,44.61
  Bottom 1.27: IO2.8 12.06,47.89 v11.56,47.94
ISO_GND  (via drill 0.6, 0.6 pad 1)  (1 unrouted)
  Top 0.305: v40.32,7.62 40.32,6.8 U2.3 | U4.5 v42.86,12.54
  Top 0.406: C3.2 v48.42,11.27
  Top 0.61: C4.2 40.38,2.64 40.77,2.25
  Bottom 0.305: v40.32,7.62 41.91,8.89 41.75,9.05
  Bottom 0.406: v48.42,11.27 47.78,11.27 47.78,12.06 42.86,12.06 v42.86,12.54
  other vias: 38.42,1.27
  pour Bottom (isolate 0.406): 50,0 49.84,14.77 49.21,15.08 43,15.05 42.48,14.52 42.48,12.63 41.59,10.48 37.68,6.78 37.68,0
ISO_IN
  Top 0.305: U4.7 45.4,12.22 | 45.4,12.22 45.4,11.27 43.66,9.53 43.66,8.57 | 43.66,8.57 43.66,7.62 43.26,7.22 42.81,7.22 CN2.3 | R27.1 45.4,12.22 | U2.4 38.62,6.71 39.37,7.46 39.37,7.94 40.01,8.57 43.66,8.57
  Top 0.406: 43.02,7.51 CN2.3
  Bottom 0.406: CN2.3 43.15,7.33 45.72,4.76 46.47,4.76 CN1.3
ISO_OUT  (via drill 0.6)
  Top 0.305: U2.2 44.31,6.05 45.56,7.3 46.47,7.3 CN1.2 | U4.6 44.13,13.65 43.81,13.34 43.81,10.95 v43.5,10.79
  Bottom 0.305: CN1.2 45.91,7.27 43.5,9.84 v43.5,10.79
ISO_VCC  (via drill 0.6 pad 1)  (1 unrouted)
  Top 0.305: 42.97,4.76 CN2.2 | U2.5 38.43,5.39 38.42,5.4 38.42,3.75 C4.1 39.05,3.87 39.05,4.45 39.21,4.6 42.39,4.6 42.57,4.79 CN2.2 | CN2.2 44,4.79 45.24,6.03 v48.26,6.03 | 46.89,14.19 46.67,13.81 | 46.67,13.81 46.67,14.13 | 46.67,14.13 U4.8 | 46.77,14.19 46.67,14.13 | 46.67,13.81 46.67,12.38 | 46.67,12.38 46.67,9.98 CN1.1 | 46.73,12.33 46.67,12.38
  Top 0.406: C3.1 46.67,14.19 U4.8
  Bottom 0.305: v48.26,6.03 48.42,6.19 48.42,9.37 47.94,9.84 46.53,9.84 CN1.1
N$1
  Top 0.305: 44.13,34.29 45.4,33.02 45.4,30.48 | 45.4,30.48 | 45.4,30.48 42.86,27.94 42.86,27.3 41.43,25.88 37.62,25.88 36.99,25.88 36.67,25.56 36.67,23.34 36.81,23.2 U$1.14
  Top 0.406: R25.1 43.97,34.29 42.7,34.29 42.86,34.13 D18.3 42.86,34.28 | 44.13,34.28 R25.1 | R25.1 44.13,34.29
N$2
  Top 0.356: 36.68,33.45 36.99,33.49 36.99,35.08 36.89,35.19 R26.1
  Top 0.406: U$1.5 38.11,30.31 36.99,31.43 36.99,33.28 | 36.99,33.28 C2.1 | 36.99,33.28 36.99,33.33 36.99,33.49
N$3
  Top 0.61: D17.2 37.98,48.62 R29.2
N$4
  Top 0.254: U$1.2 40.06,28.95 41.2,30.09 Q1.1
N$5
  Top 0.254: U$1.3 39.41,29.33 38.8,29.93 Q1.3
N$6  (via drill 0.6 pad 1)
  Top 0.305: U$1.1 40.71,28.64 41.75,29.53 v42.55,29.53 | BOOT.1 46.67,34.29 47.09,34.71 R28.1
  Bottom 0.305: v42.55,29.53 46.04,29.53 46.67,30.16 BOOT.1
N$7
  Top 0.61: 41.96,41.12 U3.1 | C6.1 40.96,43.18 C8_ALT.+ 38.26,43.5 36.99,44.77 C8.+
  Top 0.813: U3.1 41.5,41.21 41.27,41.43 C6.1 | 36.99,45.09 C8.+ 36.99,46.2 34.93,48.25 R29.1
N$8
  Top 0.305: LED1.C 48.63,30.74 R30.2
NRST  (via drill 0.6 pad 1)
  Top 0.305: v41.75,22.38 41.75,22.54 41.43,22.23 41.43,20.64 40.96,20.16 40.96,18.26 38.89,16.19 38.89,13.81 37.94,12.86 U$2.P$10 | v41.75,27.62 41.75,27.3 41.12,26.67 39.05,26.67 38.76,26.96 U$1.4
  Bottom 0.356: v41.75,22.38 v41.75,27.62
RX
  Top 0.305: U$1.18 39.41,23.21 39.69,23.5 42.7,23.5 45.4,20.8 45.4,19.68 U4.2
SWCLK
  Top 0.305: U$1.20 40.71,20.86 40.32,20.48 40.32,18.57 38.58,16.83 U$2.P$4
SWDIO
  Top 0.305: U$1.19 40.06,21.01 39.69,20.64 39.69,19.05 38.73,18.1 U$2.P$2
TX  (via drill 0.6)
  Top 0.305: U4.3 44.13,20.8 v43.97,20.95 | U$1.17 38.76,23.68 39.21,24.13 43.02,24.13 46.04,21.11 46.51,21.11 v46.51,20.95 | R30.1 46.99,29.21 46.93,29.27 46.67,29.27 46.83,29.21 45.09,29.21 44.29,28.42 v44.29,27.94
  Bottom 0.305: v46.51,20.95 v43.97,20.95 43.97,27.78 v44.29,27.94
V+  (1 unrouted)
  Top 0.406: R25.2 45.99,34.5 44.93,35.56 44.93,41.43 44.45,41.91 44.45,47.94 44.61,47.94 44.58,48.07 X1.2
  Top 0.61: D17.1 41.88,47.98 43.16,47.98 41.75,48 46.05,48 X1.2 46.58,47.47 JP1.1
  Top 1.27: IO2.7 1.43,45.35 1.47,40.48 1.47,40.27 | 1.51,12.22 1.48,17.3 1.48,17.35 IO1.7 | 1.51,12.22 1.55,7.31 | 1.55,7.31 1.59,2.11 IO1.1 | IO1.3 1.55,7.19 1.55,7.31 | IO1.5 1.51,12.27 1.51,12.22 | IO2.5 1.47,40.27 | 4.29,30.16 IO2.1 1.47,30.11 1.47,35.19 | 1.47,40.27 1.47,35.19 | IO2.3 1.47,35.19
  Bottom 1.27: 45.57,47.52 X1.2
  Bottom 1.676: IO2.7 15.35,45.35 17.52,47.52 45.57,47.52 | 4.29,40.35 15,40.35 | 15,40.35 15.35,40.35 | 15,40.35 15,45
  pour Top: 0,50 0,0 5.5,1 5.5,51